# EAGLE design transmissor_v2 (EAGLE 9.6.2)
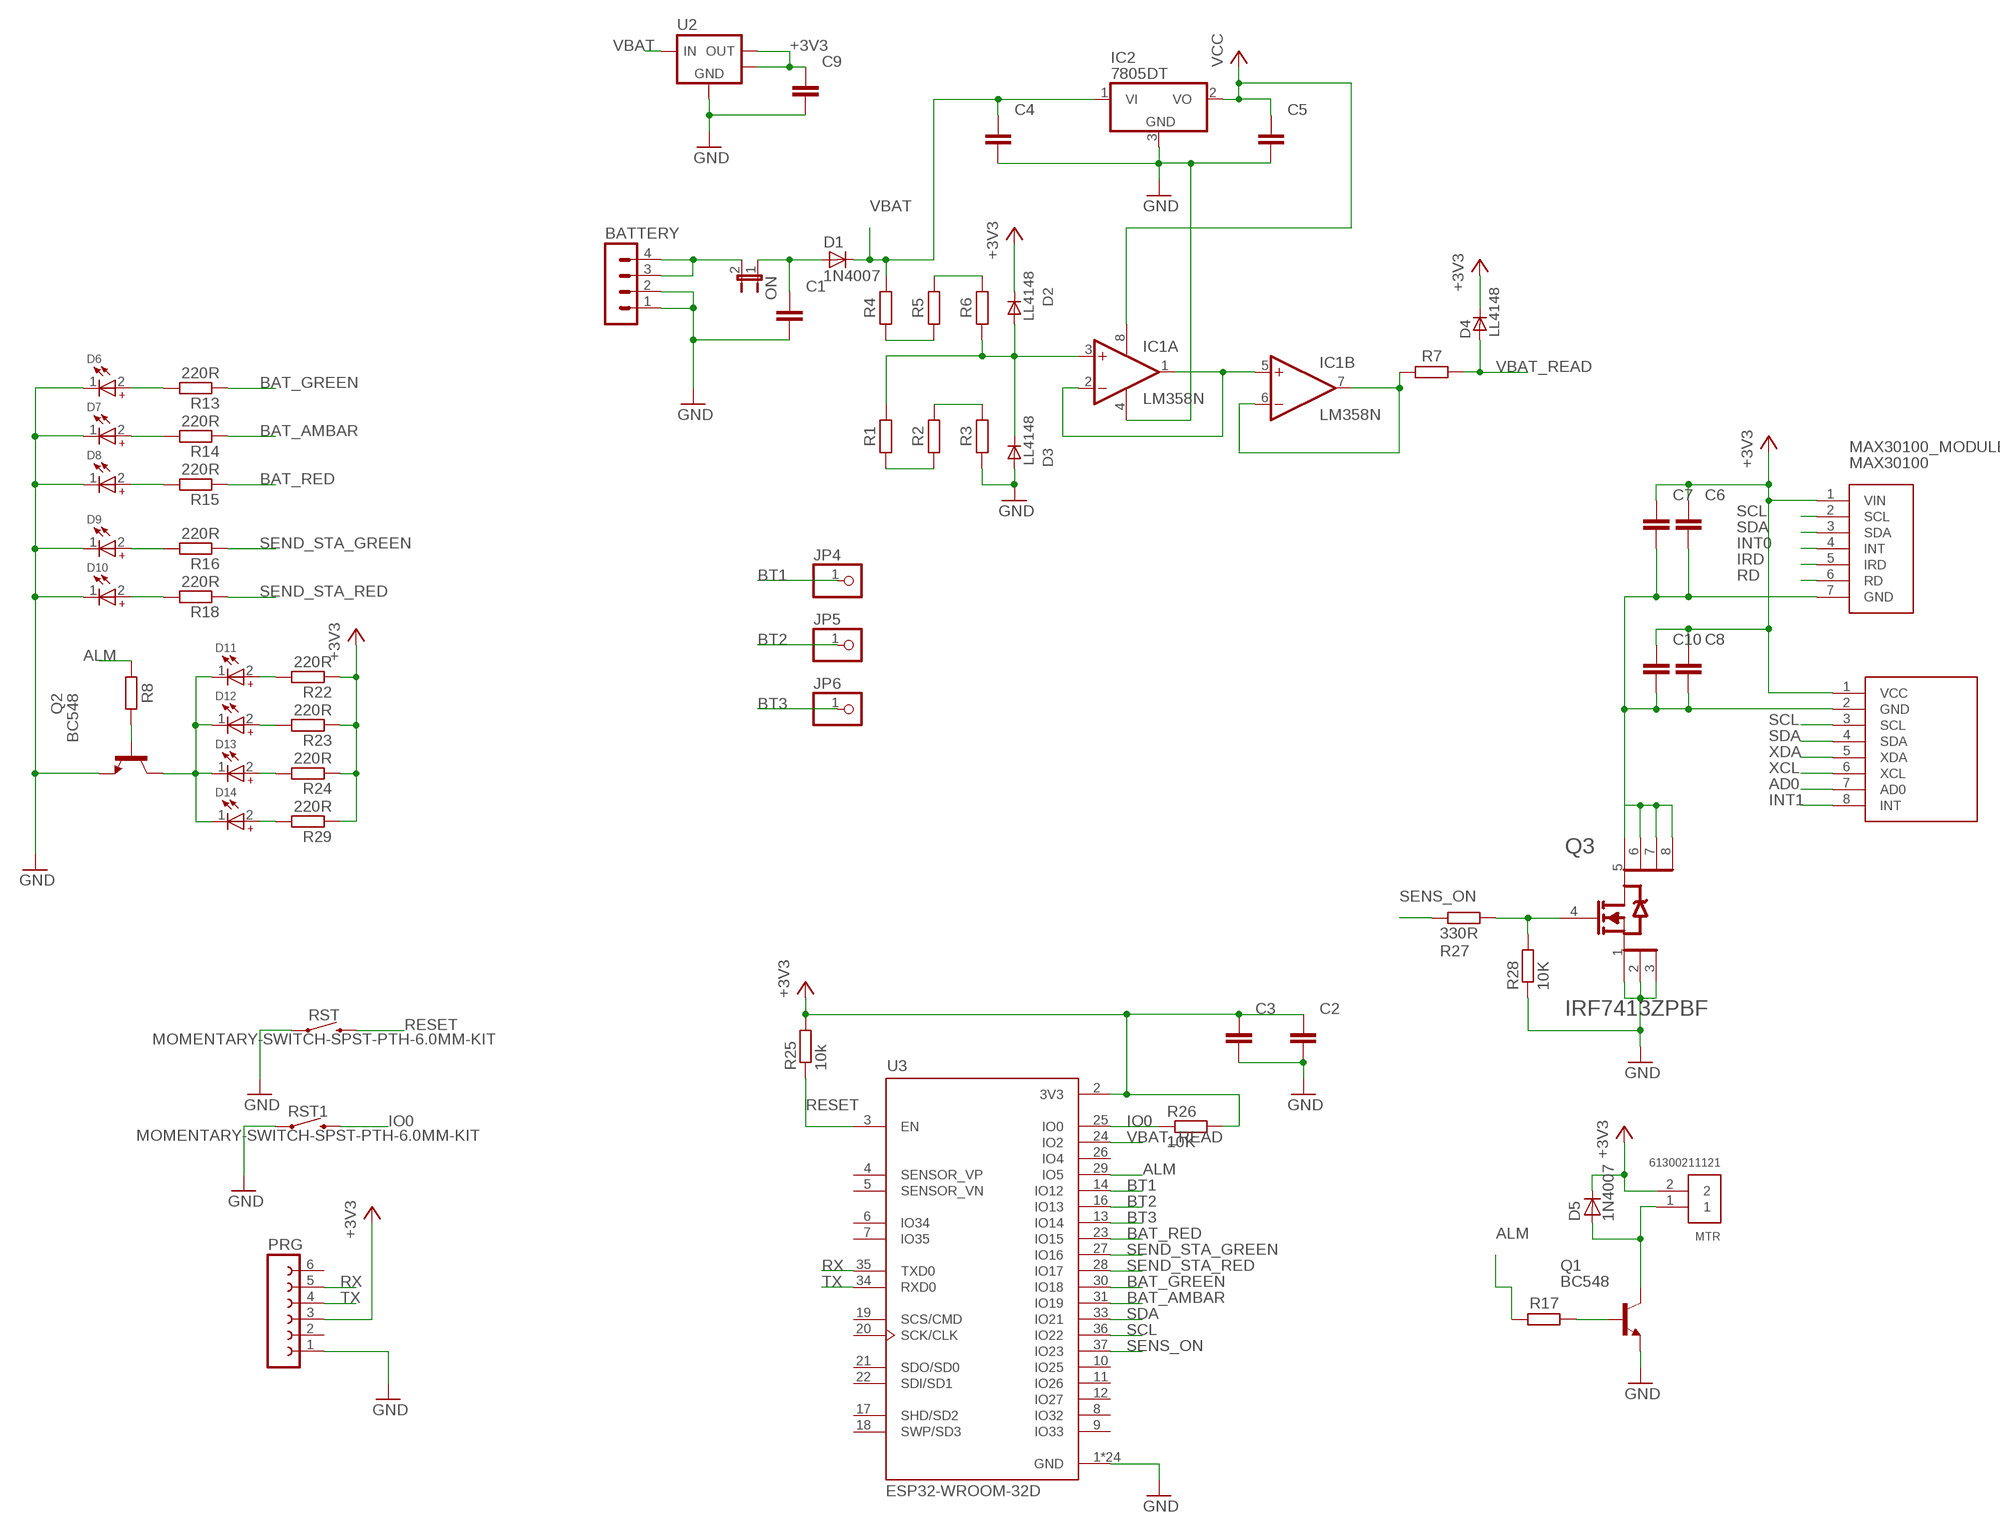
[diagram p0: schematic, sheet 1]

## Parts
BATTERY  MA04-1  [MA04-1]
C1  100nF  C_CHIP-0805(2012-METRIC)  [CAPC2012X110]
C2  100nF  C_CHIP-0805(2012-METRIC)  [CAPC2012X110]
C3  100nF  C_CHIP-0805(2012-METRIC)  [CAPC2012X110]
C4  100nF  C_CHIP-0805(2012-METRIC)  [CAPC2012X110]
C5  100nF  C_CHIP-0805(2012-METRIC)  [CAPC2012X110]
C6  100nF  C_CHIP-0805(2012-METRIC)  [CAPC2012X110]
C7  100nF  C_CHIP-0805(2012-METRIC)  [CAPC2012X110]
C8  100nF  C_CHIP-0805(2012-METRIC)  [CAPC2012X110]
C9  100nF  C_CHIP-0805(2012-METRIC)  [CAPC2012X110]
C10  100nF  C_CHIP-0805(2012-METRIC)  [CAPC2012X110]
D1  1N4007  [SMA]
D2  LL4148  [SOD80_DO213AA_MINIMELF]
D3  LL4148  [SOD80_DO213AA_MINIMELF]
D4  LL4148  [SOD80_DO213AA_MINIMELF]
D5  1N4007  [SMA]
D6  WL-SMCW_0805_150080GS75000  [WL-SMCW_0805]
D7  WL-SMCW_0805_150080AS75000  [WL-SMCW_0805]
D8  WL-SMCW_0805_150080RS75000  [WL-SMCW_0805]
D9  WL-SMCW_0805_150080GS75000  [WL-SMCW_0805]
D10  WL-SMCW_0805_150080RS75000  [WL-SMCW_0805]
D11  WL-SMCW_0805_150080RS75000  [WL-SMCW_0805]
D12  WL-SMCW_0805_150080RS75000  [WL-SMCW_0805]
D13  WL-SMCW_0805_150080RS75000  [WL-SMCW_0805]
D14  WL-SMCW_0805_150080RS75000  [WL-SMCW_0805]
IC1  LM358N  [DIL08]
IC2  7805DT  [TO252]
JP4  PINHD-1X1  [1X01]
JP5  PINHD-1X1  [1X01]
JP6  PINHD-1X1  [1X01]
MAX30100  MAX30100_MODULE  [MODULE1]
MPU6050  MPU6050MODULE  [MODULE2]
MTR  61300211121  [61300211121]
ON  JP1E  [JP1]
PRG  FE06-1  [FE06]
Q1  BC548  [TO92-EBC]
Q2  BC548  [TO92-EBC]
Q3  INFINEON_IRF7413ZPBFINFINEON_IRF7413ZPBF_0_0  [INFINEON_IRF7413ZPBF_0]
R1  2K  R_CHIP-0805(2012-METRIC)  [RESC2012X65]
R2  2K  R_CHIP-0805(2012-METRIC)  [RESC2012X65]
R3  100R  R_CHIP-0805(2012-METRIC)  [RESC2012X65]
R4  3.3K  R_CHIP-0805(2012-METRIC)  [RESC2012X65]
R5  3.3K  R_CHIP-0805(2012-METRIC)  [RESC2012X65]
R6  470R  R_CHIP-0805(2012-METRIC)  [RESC2012X65]
R7  100R  R_CHIP-0805(2012-METRIC)  [RESC2012X65]
R8  330R  R_CHIP-0805(2012-METRIC)  [RESC2012X65]
R13  220R  R-EU_R0805  [R0805]
R14  220R  R-EU_R0805  [R0805]
R15  220R  R-EU_R0805  [R0805]
R16  220R  R-EU_R0805  [R0805]
R17  330R  R_CHIP-0805(2012-METRIC)  [RESC2012X65]
R18  220R  R-EU_R0805  [R0805]
R22  220R  R-EU_R0805  [R0805]
R23  220R  R-EU_R0805  [R0805]
R24  220R  R-EU_R0805  [R0805]
R25  10k  R-EU_R0805  [R0805]
R26  10K  R-EU_R0805  [R0805]
R27  330R  R-EU_R0805  [R0805]
R28  10K  R-EU_R0805  [R0805]
R29  220R  R-EU_R0805  [R0805]
RST  MOMENTARY-SWITCH-SPST-PTH-6.0MM-KIT  [TACTILE_SWITCH_PTH_6.0MM_KIT]
RST1  MOMENTARY-SWITCH-SPST-PTH-6.0MM-KIT  [TACTILE_SWITCH_PTH_6.0MM_KIT]
U2  LM1117-SOT223  [SOT-223-3]
U3  ESP32-WROOM-32D  [MODULE_ESP32-WROOM-32D]

## Nets
+3V3: C2.1 C3.1 C6.1 C7.1 C8.1 C9.1 C10.1 D2.C D4.C D5.K(C) MAX30100.1(VIN) MPU6050.1(VCC) MTR.2 PRG.3 R22.1 R23.1 R24.1 R25.2 R26.2 R29.1 U2.2(VOUT) U2.4(HEATSINK) U3.2(3V3)
AD0: MPU6050.7(AD0)
ALM: R8.1 R17.1 U3.29(IO5)
BAT_AMBAR: R14.1 U3.31(IO19)
BAT_GREEN: R13.1 U3.30(IO18)
BAT_RED: R15.1 U3.23(IO15)
BT1: JP4.1 U3.14(IO12)
BT2: JP5.1 U3.16(IO13)
BT3: JP6.1 U3.13(IO14)
GND: BATTERY.1 BATTERY.2 C1.2 C2.2 C3.2 C4.2 C5.2 C9.2 D3.A D6.1(-) D7.1(-) D8.1(-) D9.1(-) D10.1(-) IC1.4(P:V-) IC2.3(GND) PRG.1 Q1.E Q2.E Q3.1(1_S) Q3.2(2_S) Q3.3(3_S) R3.1 R28.1 RST1.1 RST.1 U2.1(GND) U3.1(GND) U3.15(GND) U3.38(GND) U3.39_1(GND) U3.39_2(GND) U3.39_3(GND) U3.39_4(GND) U3.39_5(GND) U3.39_6(GND) U3.39_7(GND) U3.39_8(GND) U3.39_9(GND) U3.39_10(GND) U3.39_11(GND) U3.39_12(GND) U3.39_13(GND) U3.39_14(GND) U3.39_15(GND) U3.39_16(GND) U3.39_17(GND) U3.39_18(GND) U3.39_19(GND) U3.39_20(GND) U3.39_21(GND)
INT0: MAX30100.4(INT)
INT1: MPU6050.8(INT)
IO0: R26.1 RST1.3 U3.25(IO0)
IRD: MAX30100.5(IRD)
N$1: BATTERY.3 BATTERY.4 ON.2
N$2: C1.1 D1.A ON.1
N$3: IC1.6(B:-IN) IC1.7(B:OUT) R7.1
N$4: R4.1 R5.1
N$5: R5.2 R6.2
N$6: D2.A D3.C IC1.3(A:+IN) R1.2 R6.1
N$7: R1.1 R2.1
N$8: R2.2 R3.2
N$9: Q3.4(G) R27.2 R28.2
N$10: C6.2 C7.2 C8.2 C10.2 MAX30100.7(GND) MPU6050.2(GND) Q3.5(1_D) Q3.6(2_D) Q3.7(3_D) Q3.8(4_D)
N$11: D6.2(+) R13.2
N$12: D7.2(+) R14.2
N$13: D8.2(+) R15.2
N$14: D5.A MTR.1 Q1.C
N$15: Q1.B R17.2
N$16: IC1.1(A:OUT) IC1.2(A:-IN) IC1.5(B:+IN)
N$17: Q2.B R8.2
N$21: D9.2(+) R16.2
N$22: D10.2(+) R18.2
N$23: D11.1(-) D12.1(-) D13.1(-) D14.1(-) Q2.C
N$24: D11.2(+) R22.2
N$25: D12.2(+) R23.2
N$26: D13.2(+) R24.2
N$27: D14.2(+) R29.2
RD: MAX30100.6(RD)
RESET: R25.1 RST.3 U3.3(EN)
RX: PRG.5 U3.35(TXD0)
SCL: MAX30100.2(SCL) MPU6050.3(SCL) U3.36(IO22)
SDA: MAX30100.3(SDA) MPU6050.4(SDA) U3.33(IO21)
SEND_STA_GREEN: R16.1 U3.27(IO16)
SEND_STA_RED: R18.1 U3.28(IO17)
SENS_ON: R27.1 U3.37(IO23)
TX: PRG.4 U3.34(RXD0)
VBAT: C4.1 D1.K(C) IC2.1(VI) R4.2 U2.3(VIN)
VBAT_READ: D4.A R7.2 U3.24(IO2)
VCC: C5.1 IC1.8(P:V+) IC2.2(VO)
XCL: MPU6050.6(XCL)
XDA: MPU6050.5(XDA)
Unconnected: PRG.2 PRG.6 U3.4(SENSOR_VP) U3.5(SENSOR_VN) U3.6(IO34) U3.7(IO35) U3.8(IO32) U3.9(IO33) U3.10(IO25) U3.11(IO26) U3.12(IO27) U3.17(SHD/SD2) U3.18(SWP/SD3) U3.19(SCS/CMD) U3.20(SCK/CLK) U3.21(SDO/SD0) U3.22(SDI/SD1) U3.26(IO4)

## Library data of the parts
BATTERY = con-lstb:MA04-1: PIN HEADER; OC_FARNELL: unknown; OC_NEWARK: unknown
C1-C10 = Capacitor:C: Capacitor - Generic; CATEGORY: Capacitor
D1 D5 = casovac:1N4007
D2-D4 = _hhn_diodes_smd:LL4148: 1N4148 General Purpose Rectifie SMD-Version of 1N4148 Case: SOD 80 = DO 213 AA = MINIMELF (Glass) Author: Dipl.-Ing. FH Rainer Bayer HHN Hochschule Heilbronn, rainer.bayer@hs-heilbronn.de Ingenieurbüro ing-rb, mail@ing-rb.de
D6 D9 = Wurth_LEDs_WL-SMCW:WL-SMCW_0805: WL-SMCW SMT Mono-color Chip LED Waterclea Characteristics Low energy consumption High reliability Low current requirement Fast switching No UV/IR radiation Smallest SMD LED package for exceptional brightness Top view LED Wide viewing angle Better solder ability Heat dissipation Applications Backlight for mobile and portable device keypads Indoor and outdoor message boards Flat backlight for LCDs, switches and symbols Display for industrial control systems and traffic Miniaturized color effects Pedestrian mark Optical indicators Tabular backlight: LCD, telephone key-press, power-switch, display board Indoor displays Signals Identifiers Backlight for automobile DVD LED General lighting Toys <https://www.we-online.com/catalog/media/o14904v209%20Family_WL-SMCW.jpg> Details see: https://www.we-online.com/catalog/en/WL-SMCW/ Updated BY Yingchun,Shan 2020-03-18 2020(C) Wurth Elektronik; ABSTRAHLWINKEL: 140°; CHIP-TECHNOLOGY: InGaN; DATASHEET-URL: https://www.we-online.com/catalog/datasheet/150080GS75000.pdf; EMITTING-COLOR: Green; I-V-TYP: 450mcd; LAMDA-DOM-TYP: 525nm; LAMDA-PEAK-TYP: 515nm; PART-NUMBER: 150080GS75000; V-F-TYP: 3.2V
D7 = Wurth_LEDs_WL-SMCW:WL-SMCW_0805: WL-SMCW SMT Mono-color Chip LED Waterclea Characteristics Low energy consumption High reliability Low current requirement Fast switching No UV/IR radiation Smallest SMD LED package for exceptional brightness Top view LED Wide viewing angle Better solder ability Heat dissipation Applications Backlight for mobile and portable device keypads Indoor and outdoor message boards Flat backlight for LCDs, switches and symbols Display for industrial control systems and traffic Miniaturized color effects Pedestrian mark Optical indicators Tabular backlight: LCD, telephone key-press, power-switch, display board Indoor displays Signals Identifiers Backlight for automobile DVD LED General lighting Toys <https://www.we-online.com/catalog/media/o14904v209%20Family_WL-SMCW.jpg> Details see: https://www.we-online.com/catalog/en/WL-SMCW/ Updated BY Yingchun,Shan 2020-03-18 2020(C) Wurth Elektronik; ABSTRAHLWINKEL: 140°; CHIP-TECHNOLOGY: AlInGaP; DATASHEET-URL: https://www.we-online.com/catalog/datasheet/150080AS75000.pdf; EMITTING-COLOR: Amber; I-V-TYP: 130mcd; LAMDA-DOM-TYP: 605nm; LAMDA-PEAK-TYP: 610nm; PART-NUMBER: 150080AS75000; V-F-TYP: 2V
D8 D10-D14 = Wurth_LEDs_WL-SMCW:WL-SMCW_0805: WL-SMCW SMT Mono-color Chip LED Waterclea Characteristics Low energy consumption High reliability Low current requirement Fast switching No UV/IR radiation Smallest SMD LED package for exceptional brightness Top view LED Wide viewing angle Better solder ability Heat dissipation Applications Backlight for mobile and portable device keypads Indoor and outdoor message boards Flat backlight for LCDs, switches and symbols Display for industrial control systems and traffic Miniaturized color effects Pedestrian mark Optical indicators Tabular backlight: LCD, telephone key-press, power-switch, display board Indoor displays Signals Identifiers Backlight for automobile DVD LED General lighting Toys <https://www.we-online.com/catalog/media/o14904v209%20Family_WL-SMCW.jpg> Details see: https://www.we-online.com/catalog/en/WL-SMCW/ Updated BY Yingchun,Shan 2020-03-18 2020(C) Wurth Elektronik; ABSTRAHLWINKEL: 140°; CHIP-TECHNOLOGY: AlInGaP; DATASHEET-URL: https://www.we-online.com/catalog/datasheet/150080RS75000.pdf; EMITTING-COLOR: Red; I-V-TYP: 150mcd; LAMDA-DOM-TYP: 625nm; LAMDA-PEAK-TYP: 630nm; PART-NUMBER: 150080RS75000; V-F-TYP: 2V
IC1 = linear:LM358: OP AMP also LM158; LM258; LM2904 Source: http://cache.national.com/ds/LM/LM158.pdf
IC2 = linear:78*: Positive VOLTAGE REGULATOR Source: http://cache.national.com/ds/LM/LM78L05.pdf http://www.fairchildsemi.com/ds/LM/LM7805.pdf
JP4-JP6 = adafruit:PINHD-1X1: Pin header 1x1 for 0.1" spacing With round pins
MAX30100 = my_lib:MAX30100_MODULE
MPU6050 = my_lib:MPU6050
MTR = Headers:61300211121: CONN HEADER VERT 2POS 2.54MM Manufacturer's datasheet <https://katalog.we-online.de/em/datasheet/6130xx11121.pdf>; CREATED_BY: PCBLayout.com; DIGI_KEY_PART_NUMBER: 732-5315-ND; MANUFACTURER: Wurth Electronics Inc.; MPN: 61300211121
ON = jumper:JP1E: JUMPER
PRG = con-lsta:FE06-1: FEMALE HEADER; OC_FARNELL: unknown; OC_NEWARK: unknown
Q1 Q2 = transistor-npn:BC548*: NPN Transistor
Q3 = Infineon - IRF7413ZPBF:INFINEON_IRF7413ZPBF: HEXFET Power MOSFET; CENTROID_NOT_SPECIFIED: No; DATASHEET: http://www.infineon.com/dgdl/irf7413zpbf.pdf?fileId=5546d462533600a4015355fab6901bc2; DIGIKEY_DESCRIPTION: TRANS MOSFET N-CH 30V 13A 8-SOIC; DIGIKEY_PART_NUMBER: IRF7413ZPBF-ND; LEAD_FREE: yes; MF: Infineon; MOUSER_PART_NUMBER: 942-IRF7413ZPBF; MPN: IRF7413ZPBF; PACKAGE: SO8; PREFIX: Q; ROHS: yes; TEMPERATURE_RANGE_HIGH: +150°C; TEMPERATURE_RANGE_LOW: -55°C
R1-R8 R17 = Resistor:R: Resistor Fixed - Generic; CATEGORY: Resistor; SUB-CATEGORY: Fixed
R13-R16 R18 R22-R29 = rcl:R-EU_: RESISTOR, European symbol; SPICEPREFIX: R
RST RST1 = SparkFun-Switches:MOMENTARY-SWITCH-SPST: Momentary Switch (Pushbutton) - SPST Normally-open (NO) SPST momentary switches (buttons, pushbuttons). Variants PTH-12MM - 12mm square, through-hole Momentary Pushbutton Switch - 12mm Square <https://www.sparkfun.com/products/9190> (COM-09190) PTH-6.0MM, PTH-6.0MM-KIT - 6.0mm square, through-hole Mini Pushbutton Switch <https://www.sparkfun.com/products/97> (COM-00097) KIT package intended for soldering kit's - only one side of pads' copper is exposed. PTH-RIGHT-ANGLE-KIT - Right-angle, through-hole Right Angle Tactile Button <https://www.sparkfun.com/products/10791> - Used on SparkFun BigTime Watch Kit <https://www.sparkfun.com/products/11734> SMD-12MM - 12mm square, surface-mount Tactile Button - SMD (12mm) <https://www.sparkfun.com/products/12993> (COM-12993) Used on SparkFun PicoBoard <https://www.sparkfun.com/products/11888> SMD-4.5MM - 4.5mm Square Trackball Switch Used on SparkFun Blackberry Trackballer Breakout <https://www.sparkfun.com/products/13169> SMD-4.6MMX2.8MM - 4.60mm x 2.80mm, surface mount Used on SparkFun SAMD21 Mini Breakout <https://www.sparkfun.com/products/13664> SMD-5.2MM, SMD-5.2-REDUNDANT - 5.2mm square, surface-mount Mini Pushbutton Switch - SMD <https://www.sparkfun.com/products/8720> (COM-08720) Used on Arduino Pro Mini <https://www.sparkfun.com/products/11114> REDUNDANT package connects both switch circuits together SMD-6.0X3.5MM - 6.0 x 3.5mm, surface mount Momentary Reset Switch SMD <https://www.sparkfun.com/products/8229> (COM-08229) SMD-6.2MM-TALL - 6.2mm square, surface mount Tactile Button - SMD (6mm) <https://www.sparkfun.com/products/12992> Used on SparkFun Digital Sandbox <https://www.sparkfun.com/products/12651> SMD-RIGHT-ANGLE - Right-angle, surface mount Used on SparkFun Block for Intel® Edison - Arduino <https://www.sparkfun.com/products/13036>; PROD_ID: SWCH-08441; SF_SKU: COM-00097
U2 = bt_regulator:LM1117: LDO Voltage Regulator NCP1117 Output Current in Excess of 1.0 A 1.2 V Maximum Dropout Voltage at 800 mA Over Temperature Fixed Output Voltages of 1.5, 1.8, 1.9, 2.0, 2.5, 2.85, 3.3, 5.0, and 12 V Adjustable Output Voltage Option No Minimum Load Requirement for Fixed Voltage Output Devices Reference/Output Voltage Trimmed to ±1.0% Current Limit, Safe Operating and Thermal Shutdown Protection Operation to 20 V Input NCV Prefix for Automotive and Other Applications Requiring Unique Site and Control Change Requirements; AEC−Q100 Qualified and PPAP Capable datasheet.pdf <http://www.onsemi.com/pub/Collateral/NCP1117-D.PDF> LM1117 Available in 1.8 V, 2.5 V, 3.3 V, 5 V, and adjustable versions Output Current 800 mA Current Limiting and Thermal Protection Space-Saving SOT-223 and WSON Packages Line Regulation 0.2% (Maximum) Load Regulation 0.4% (Maximum) Temperature: LM1117: 0°C to 125°C; LM1117I: −40°C to 125°C LM1117 (Rev. N) is a series of low dropout voltage regulators of 1.2V at 800mA of load current. It has the same pin-out as Texas Instruments' industry standard LM317. The LM1117-N is available in an adjustable version, available in five fixed voltages, 1.8V, 2.5V, 2.85V, 3.3V, and 5V. The LM1117-N offers current limiting and thermal shutdown. Its circuit includes a zener trimmed to within ±1%. datasheet.pdf <http://www.ti.com/lit/ds/symlink/lm1117.pdf>
U3 = ESP32-WROOM-32D:ESP32-WROOM-32D: Bluetooth, WiFi 802.11b/g/n, Bluetooth v4.2 + EDR, Class 1, 2 and 3 Transceiver Module 2.4GHz ~ 2.5GHz Integrated, Trace Surface Mount Check prices <https://pricing.snapeda.com/parts/ESP32-WROOM-32D/Espressif%20Systems/view-part?ref=eda>; AVAILABILITY: Bad; DESCRIPTION: Bluetooth, WiFi 802.11b/g/n, Bluetooth v4.2 +EDR, Class 1, 2 and 3 Transceiver Module 2.4GHz ~ 2.5GHz Integrated; MF: Espressif Systems; MP: ESP32-WROOM-32D; PACKAGE: Module Espressif Systems; PRICE: None

## Board
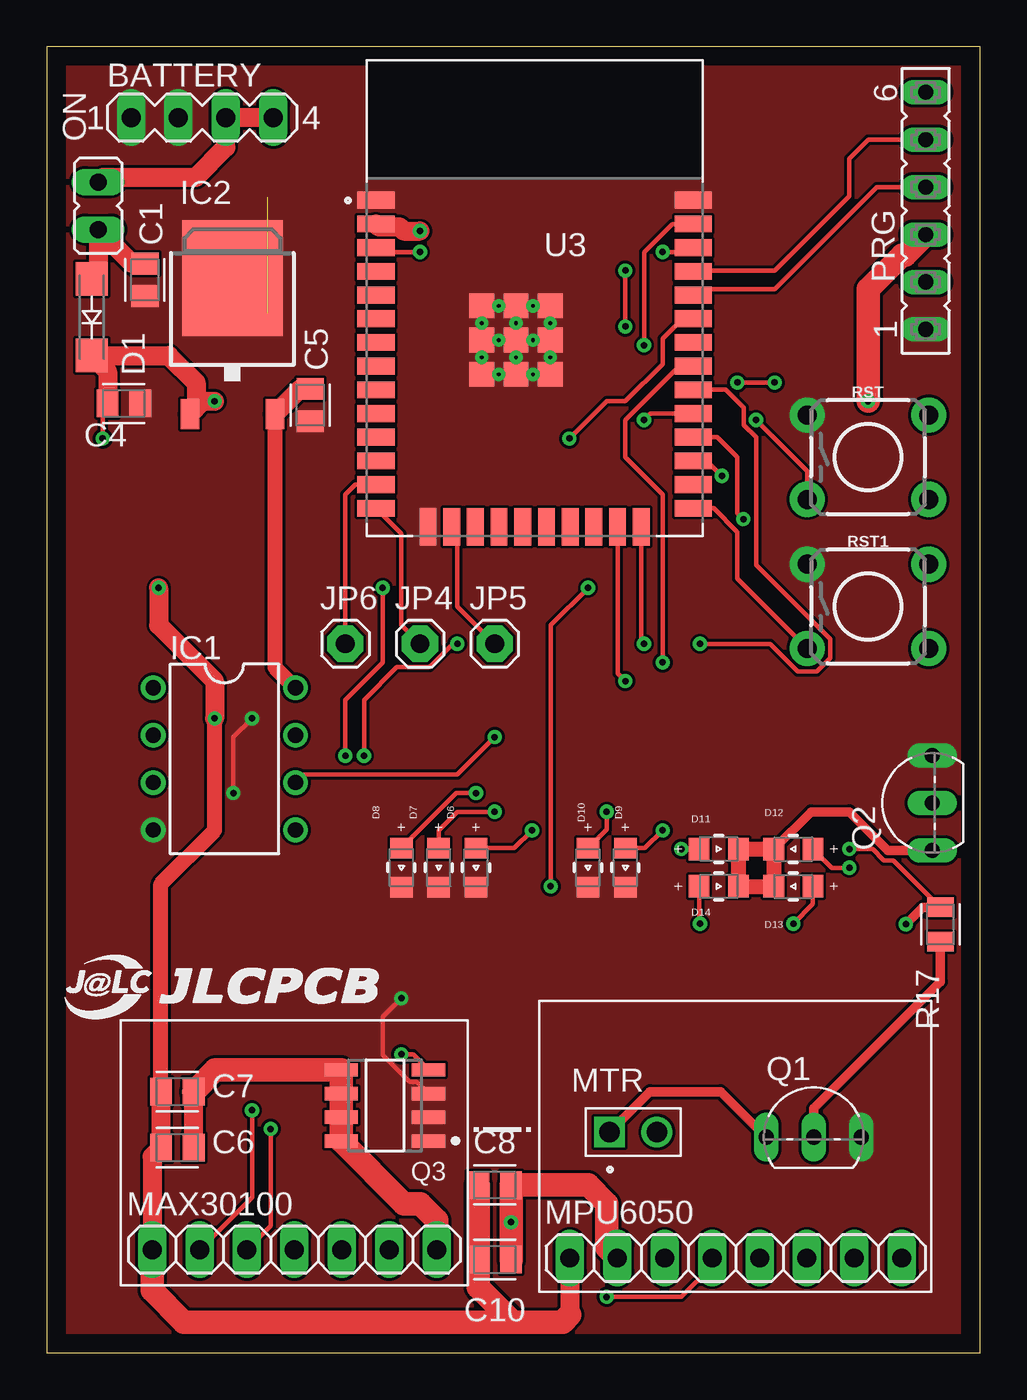
[diagram p1: board, top side]
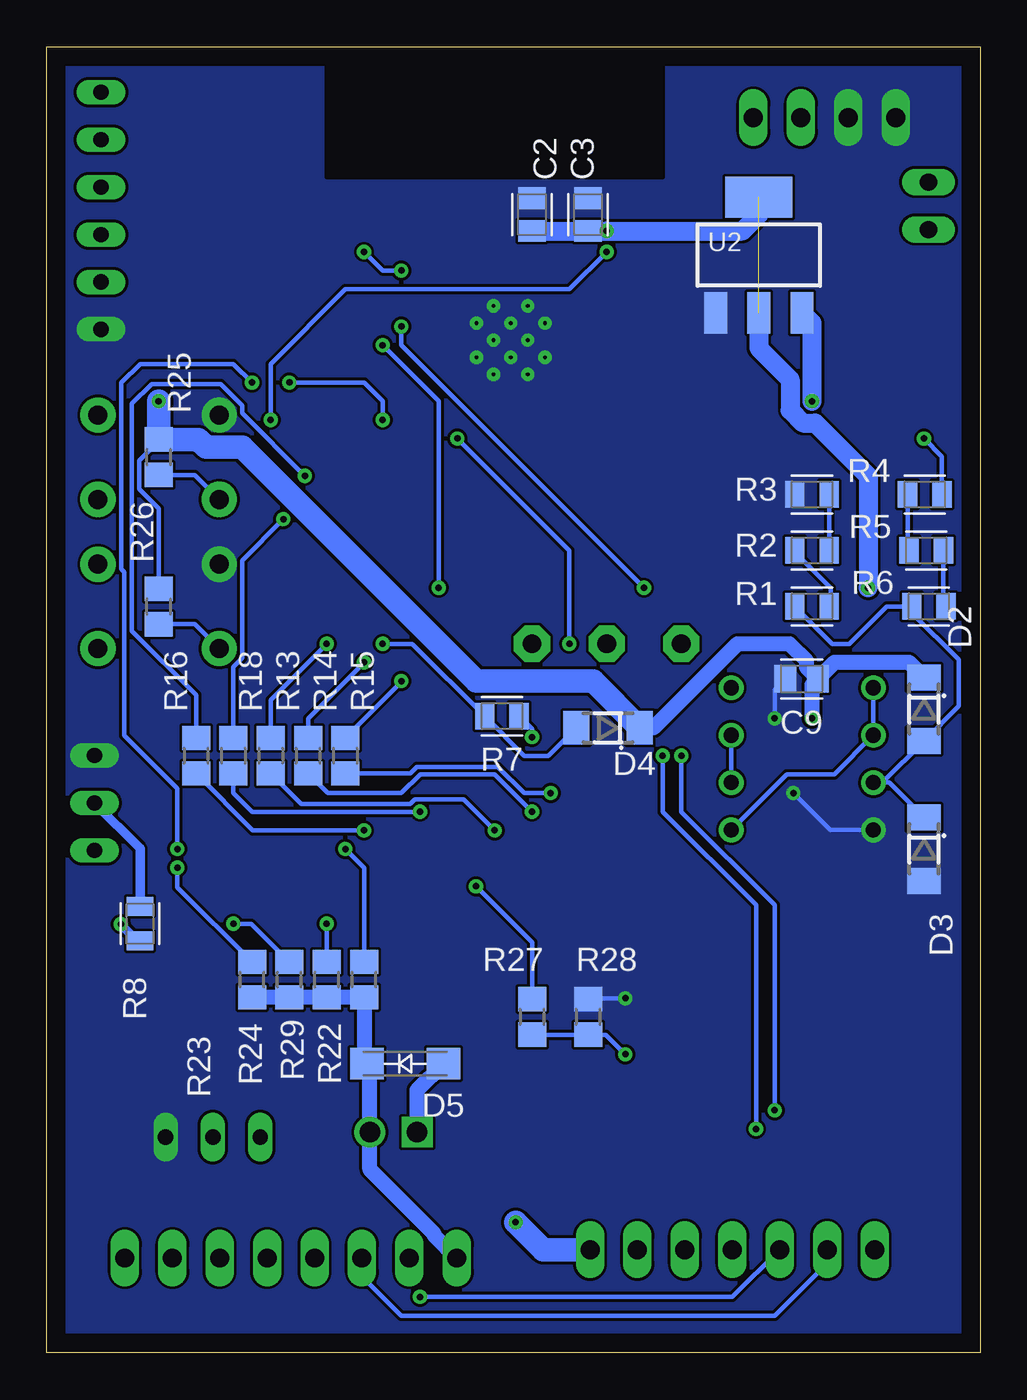
[diagram p2: board, bottom side, seen from below]

Size 50 x 70 mm. Coordinates in mm from the lower left corner, seen from the top.
Outline: 0,0 50,0 50,70 0,70 0,0
Copper layers (1*16): Top 0.035mm / dielectric 1.5mm / Bottom 0.035mm
Design rules "default": minimum track width 6mil, minimum drill 0.35mm, track to track 6mil, track to pad 6mil, pad to pad 6mil, via to via 6mil, smd to smd 6mil, copper to edge 40mil, drill to drill 6mil, minimum pad ring 10mil, minimum via ring 8mil, stop-mask expansion 4mil, vias tented up to drill 0mil, thermal gap 10mil

### Footprints (pad centres in the part's own frame; a part is rotated, then mirrored left to right if it is on the bottom)
MA04-1 = drill 1.016 long: 1 -3.81,0; 2 -1.27,0; 3 1.27,0; 4 3.81,0
CAPC2012X110 = smd 1.165 x 1.465: 1 -0.875,0; 2 0.875,0
SMA = smd 1.8 x 1.7: A -2.05,0; K 2.05,0
SOD80_DO213AA_MINIMELF = smd 1.4 x 1.8: A 1.7,0; C -1.7,0
WL-SMCW_0805 = smd 1.1 x 1.2: 1 -1.05,0; 2 1.05,0
DIL08 = drill 0.813 pad 1.27: 1 -3.81,-3.81; 2 -1.27,-3.81; 3 1.27,-3.81; 4 3.81,-3.81; 5 3.81,3.81; 6 1.27,3.81; 7 -1.27,3.81; 8 -3.81,3.81
TO252 = smd 1 x 1.6: 1 -2.28,-4.8; 2 2.28,-4.8 | smd 5.4 x 6.2: 3 0,2.5
1X01 = drill 1.016 pad 1.93 octagon: 1 0,0
MODULE1 = drill 1.016 long: 1 -7.31,-5.09; 2 -4.77,-5.09; 3 -2.23,-5.09; 4 0.31,-5.09; 5 2.85,-5.09; 6 5.39,-5.09; 7 7.93,-5.09
MODULE2 = drill 1.016 long: 1 1.64,1.81; 2 4.18,1.81; 3 6.72,1.81; 4 9.26,1.81; 5 11.8,1.81; 6 14.34,1.81; 7 16.88,1.81; 8 19.42,1.81
61300211121 = drill 1.1 square: 1 -1.27,0 | drill 1.1: 2 1.27,0
JP1 = drill 0.914 long: 1 0,-1.27; 2 0,1.27
FE06 = drill 0.813 long: 1 -6.35,0; 2 -3.81,0; 3 -1.27,0; 4 1.27,0; 5 3.81,0; 6 6.35,0
TO92-EBC = drill 0.813 long: B 0,-1.27; C -2.54,-1.27; E 2.54,-1.27
INFINEON_IRF7413ZPBF_0 = smd 0.72 x 1.78: 1 -1.905,-2.34; 2 -0.635,-2.34; 3 0.635,-2.34; 4 1.905,-2.34; 5 1.905,2.34; 6 0.635,2.34; 7 -0.635,2.34; 8 -1.905,2.34
RESC2012X65 = smd 1.031 x 1.42: 1 -0.919,0; 2 0.919,0
R0805 = smd 1.3 x 1.5: 1 -0.95,0; 2 0.95,0
TACTILE_SWITCH_PTH_6.0MM_KIT = drill 1.016 pad 1.88: 1 -3.251,2.261; 2 3.251,2.261; 3 -3.251,-2.261; 4 3.251,-2.261
SOT-223-3 = smd 1.219 x 2.235: 1 -2.311,-3.099; 2 0,-3.099; 3 2.311,-3.099 | smd 3.6 x 2.2: 4 0,3.099
MODULE_ESP32-WROOM-32D = smd 2 x 0.9: 1 -8.5,5.26; 2 -8.5,3.99; 3 -8.5,2.72; 4 -8.5,1.45; 5 -8.5,0.18; 6 -8.5,-1.09; 7 -8.5,-2.36; 8 -8.5,-3.63; 9 -8.5,-4.9; 10 -8.5,-6.17; 11 -8.5,-7.44; 12 -8.5,-8.71; 13 -8.5,-9.98; 14 -8.5,-11.25; 25 8.5,-11.25; 26 8.5,-9.98; 27 8.5,-8.71; 28 8.5,-7.44; 29 8.5,-6.17; 30 8.5,-4.9; 31 8.5,-3.63; 32 8.5,-2.36; 33 8.5,-1.09; 34 8.5,0.18; 35 8.5,1.45; 36 8.5,2.72; 37 8.5,3.99; 38 8.5,5.26 | smd 0.9 x 2: 15 -5.715,-12.25; 16 -4.445,-12.25; 17 -3.175,-12.25; 18 -1.905,-12.25; 19 -0.635,-12.25; 20 0.635,-12.25; 21 1.905,-12.25; 22 3.175,-12.25; 23 4.445,-12.25; 24 5.715,-12.25 | smd 1.33 x 1.33: 39_1 -2.835,-0.405; 39_2 -1,-0.405; 39_3 0.835,-0.405; 39_4 -2.835,-2.24; 39_5 -1,-2.24; 39_6 0.835,-2.24; 39_7 -2.835,-4.075; 39_8 -1,-4.075; 39_9 0.835,-4.075 | drill 0.2 pad 0.3: 39_10 -1.917,-0.405; 39_11 -0.083,-0.405; 39_12 -2.835,-1.323; 39_13 -1,-1.323; 39_14 0.835,-1.323; 39_15 -1.917,-2.24; 39_16 -0.083,-2.24; 39_17 -2.835,-3.158; 39_18 -1,-3.158; 39_19 0.835,-3.158; 39_20 -1.917,-4.075; 39_21 -0.083,-4.075

### Placement (x,y rotation side)
BATTERY  8.33,66.2 0 top
C1  5.26,57.5 270 top
C2  24,61 90 bottom
C3  21,61 90 bottom
C4  4.14,50.88 0 top
C5  14.12,50.79 270 top
C6  7,11 0 top
C7  7,14 0 top
C8  24,9 0 top
C9  9.56,36.12 180 bottom
C10  24,5 0 top
D1  2.41,55.5 270 top
D2  3,34.5 270 bottom
D3  3,27 270 bottom
D4  19.93,33.5 180 bottom
D5  30.79,15.5 180 bottom
D6  23,26 90 top
D7  21,26 90 top
D8  19,26 90 top
D9  31,26 90 top
D10  29,26 90 top
D11  36,27 180 top
D12  40,27 0 top
D13  40,25 0 top
D14  36,25 180 top
IC1  9.52,31.83 270 top
IC2  9.95,55.1 0 top
JP4  20,38 0 top
JP5  24,38 0 top
JP6  16,38 0 top
MAX30100  12.96,10.62 0 top
MPU6050  26.39,3.27 0 top
MTR  31.42,11.83 0 top
ON  2.76,61.47 0 top
PRG  47.09,61.2 90 top
Q1  41.09,12.83 0 top
Q2  46.17,29.47 90 top
Q3  18.12,13.26 90 top
R1  9,40 180 bottom
R2  9,43 0 bottom
R3  9,46 0 bottom
R4  2.96,46 0 bottom
R5  2.88,43 0 bottom
R6  2.74,40 0 bottom
R7  25.61,34.12 180 bottom
R8  45,23 90 bottom
R13  38,32 270 bottom
R14  36,32 270 bottom
R15  34,32 270 bottom
R16  42,32 270 bottom
R17  47.88,22.96 270 top
R18  40,32 270 bottom
R22  33,20 90 bottom
R23  39,20 90 bottom
R24  37,20 90 bottom
R25  44,48 90 bottom
R26  44,40 90 bottom
R27  24,18 270 bottom
R28  21,18 270 bottom
R29  35,20 90 bottom
RST  44,48 0 top
RST1  44,40 0 top
U2  11.85,58.83 0 bottom
U3  26.14,56.51 0 top

### Tracks (layer width: path | path; a pad name or v marks a point on that pad's centre or on a via)
+3V3  (via drill 0.35)  (1 unrouted)
  Top 0.813: C7.1 6.12,25.12 9,28 v9,34
  Top 1.016: U3.2 17.8,60.34 18.91,60.34 19.13,60.12 v20,60.12 | C7.1 C6.1 5.65,10.53 MAX30100.1 | v6,41 6,39 9,36 v9,34 | MPU6050.1 28.03,2.03
  Top 1.27: C8.1 C10.1 23.12,3.53 25,1.65 | 25,1.65 27.65,1.65 28.03,2.03 | MAX30100.1 5.65,3.35 7.35,1.65 25,1.65 | PRG.3 46,58.84 45.83,58.84 44,57.01 v44,51
  Bottom 0.254: 44.05,48.95 R25.2 | R26.2 44,45.25 45.03,46.28 45.03,47.82 44,48.85 44,49
  Bottom 0.813: MPU6050.1 29.25,6.3 29.25,6.39 32.69,9.83 MTR.2 32.69,15.35 D5.K 33,15.66 R22.1 R29.1 R24.1 R23.1 | D2.C 3.8,37 7.8,37 C9.1 | C9.1 9.29,36.73 9.29,37.08 10.21,38 13,38 17.5,33.5 D4.C | v9,34 9,35.8 C9.1
  Bottom 1.016: U2.4 11.85,61 12.73,60.12 v20,60.12 C3.1 C2.1 | U2.2 11.85,53.85 10.17,52.17 10.17,50.52 9.48,49.83 8.83,49.83 6,47 v6,41
  Bottom 1.27: v44,51 44,49 44.05,48.95 | R25.2 41.88,48.95 41.46,48.53 39.53,48.53 27,36 20.73,36 D4.C
ALM  (via drill 0.35)
  Top 0.254: R17.1 45.36,26.4 44.85,26.4 44.25,27 v43,27 | v39,52 v37,52 | v32,50 32.34,50.34 U3.29
  Top 0.508: v46.03,22.97 46.94,23.88 R17.1
  Bottom 0.254: v43,27 43,30.25 45.84,33.1 45.84,41.84 46,42 46,52 45,53 40,53 v39,52 | v37,52 33,52 32,51 v32,50
  Bottom 0.508: R8.1 45.14,22.08 v46.03,22.97
BAT_AMBAR  (via drill 0.35)
  Top 0.254: U3.31 33.88,52.88 31,50 31,48 33,46 v33,37
  Bottom 0.254: R14.1 36,34 v33,37
BAT_GREEN  (via drill 0.35)
  Top 0.254: v35,38 38.76,38 40.24,36.52 41.25,36.52 41.97,37.23 41.97,38.24 38,42.21 38,49.07 37.34,49.73 37.34,50.66 36.39,51.61 U3.30
  Bottom 0.254: R13.1 38,35 v35,38
BAT_RED  (via drill 0.35)
  Top 0.254: v31,36 30.58,36.41 U3.23
  Bottom 0.254: R15.1 31,35.95 v31,36
BT1
  Top 0.254: U3.14 19,43.9 19,39 JP4.1
BT2
  Top 0.254: U3.16 22,43.95 22,40 JP5.1
BT3
  Top 0.254: U3.13 16.53,46.53 16,46 JP6.1
GND  (via drill 0.35)
  Top 0.254: v10,30 10,33 v11,34 | Q3.3 19.83,14.53 19.45,14.53 18,15.98 18,18 v19,19
  Bottom 0.254: IC1.4 8.02,28.02 v10,30 | v11,34 11,35.56 C9.2 | v19,19 20.95,19 R28.1
  cutout Bottom (no thermals): 17,69 17,63 35,63 35,69
  pour Bottom (no thermals): 0,70 0,0 50,0 50,70
  pour Top (no thermals): 0,70 50,70 50,0 0,0
IO0
  Top 0.254: RST1.3 37,41.49 37,44 35.74,45.26 U3.25
  Bottom 0.254: RST1.3 42.06,39.05 R26.1
N$1
  Top 1.016: BATTERY.4 BATTERY.3 9.6,64.6 8,63 3.02,63 ON.2
N$2
  Top 1.016: D1.A 2.76,57.9 ON.1 4.58,58.38 C1.1
N$3  (via drill 0.35)
  Top 0.254: v24,33 22,31 13.77,31 IC1.6
  Bottom 0.254: IC1.6 IC1.7 | R7.1 24,33.43 v24,33
N$4
  Bottom 0.254: R4.1 3.88,43.08 R5.1
N$5
  Bottom 0.254: R5.2 1.96,40.14 R6.2
N$6
  Bottom 0.254: R1.2 7.92,38 7,38 5,40 R6.1 3.66,39.66 1.14,37.14 1.14,34.66 D2.A 5.24,30.56 IC1.3 4.86,30.56 D3.C
N$7
  Bottom 0.254: R2.1 9.92,42.92 8,41 8,40.08 R1.1
N$8
  Bottom 0.254: R3.2 R2.2
N$9  (via drill 0.35)
  Top 0.254: Q3.4 19.62,16 v19,16
  Bottom 0.254: R27.2 R28.2 20.05,17.05 v19,16
N$10  (via drill 0.35)
  Top 1.016: C6.2 C7.2
  Top 1.27: C7.2 9.04,15.16 Q3.5 Q3.6 Q3.7 Q3.8 19.13,8 20,8 20.89,7.11 MAX30100.7 | C10.2 v24.88,7 C8.2 29,9 30,8 30,5.65 MPU6050.2
  Bottom 1.27: MAX30100.7 23.41,5.53 v24.88,7
N$11  (via drill 0.35)
  Top 0.254: v26,28 25.05,27.05 D6.2
  Bottom 0.254: R13.2 36.36,29.41 30.52,29.41 30.27,29.66 27.66,29.66 v26,28
N$12  (via drill 0.35)
  Top 0.254: v24,29 22,29 21,28 D7.2
  Bottom 0.254: R14.2 34.95,30 31,30 30,31 26,31 v24,29
N$13  (via drill 0.35)
  Top 0.254: v23,30 21.95,30 D8.2
  Bottom 0.254: R15.2 30.52,31.05 30.17,31.41 25.83,31.41 24.43,30 v23,30
N$14
  Top 0.508: MTR.1 32.32,14 36.11,14 Q1.C
  Bottom 0.813: MTR.1 30.15,14.09 D5.A
N$15
  Top 0.508: Q1.B 41.09,13.09 47.88,19.88 R17.2
N$16
  Bottom 0.254: IC1.1 IC1.2 7.81,31 10.35,31 IC1.5
N$17
  Bottom 0.508: R8.2 45,27.03 Q2.B
N$21  (via drill 0.35)
  Top 0.254: v33,28 32.05,27.05 D9.2
  Bottom 0.254: R16.2 38.95,28 v33,28
N$22  (via drill 0.35)
  Top 0.254: v30,29 30,28.05 D10.2
  Bottom 0.254: R18.2 40,30 39,29 v30,29
N$23
  Top 0.508: D12.1 40.95,29 43,29 45.07,26.93 Q2.C
  Top 0.813: D11.1 D12.1 D13.1 D14.1 D11.1
N$24  (via drill 0.35)
  Top 0.254: v34,27 D11.2
  Bottom 0.254: R22.2 33,26 v34,27
N$25  (via drill 0.35)
  Top 0.254: v43,26 42.05,26 D12.2
  Bottom 0.254: R23.2 43,24.95 v43,26
N$26  (via drill 0.35)
  Top 0.254: v40,23 41.05,24.05 D13.2
  Bottom 0.254: R24.2 39.05,23 v40,23
N$27  (via drill 0.35)
  Top 0.254: v35,23 34.95,23.05 D14.2
  Bottom 0.254: R29.2 v35,23
RESET  (via drill 0.35)
  Top 0.254: RST.3 40.75,47.25 v38,50 | U3.3 17.87,59 v20,59
  Bottom 0.254: RST.3 42.06,47.05 R25.1 | v20,59 22,57 34,57 38,53 v38,50
RX
  Top 0.254: U3.35 34.68,58 39,58 43,62 43,64 44.01,65.01 PRG.5
SCL  (via drill 0.35)
  Top 0.254: MAX30100.2 11,8.34 v11,13 | v16,32 16,35 18,37 v18,41 | v31,55 v31,58 | v33,59 34.41,59 U3.36
  Bottom 0.254: MAX30100.2 8.19,4.81 11,2 31,2 33.11,4.11 MPU6050.3 | v11,13 11,24 16,29 v16,32 | v18,41 31,54 v31,55 | v31,58 32,58 v33,59
SDA  (via drill 0.35)
  Top 0.254: v30,3 34,3 35.65,4.65 MPU6050.4 | MAX30100.3 12,6.8 v12,12 | v17,32 17,35 18.76,36.76 20.52,36.76 21.76,38 v22,38 | v28,49 30,51 31,51 33,53 33,54.36 34.06,55.42 U3.33
  Bottom 0.254: MAX30100.3 13.26,3 v30,3 | v17,32 17,29 12,24 v12,12 | v22,38 22,43 v28,49
SEND_STA_GREEN  (via drill 0.35)
  Top 0.254: v36.17,47 35.37,47.8 U3.27
  Bottom 0.254: v36.17,47 39.53,50.36 39.53,50.77 40.68,51.91 44.38,51.91 45.44,50.86 45.44,38.69 42,35.25 R16.1
SEND_STA_RED  (via drill 0.35)
  Top 0.254: v37.32,44.68 37,45 37,48 35.93,49.07 U3.28
  Bottom 0.254: R18.1 40,36.76 39.53,37.23 39.53,42.47 v37.32,44.68
SENS_ON  (via drill 0.35)
  Top 0.254: v27,25 27,39 v29,41 | v32,54 32,59 33.5,60.5 U3.37
  Bottom 0.254: R27.1 24,22 v27,25 | v29,41 29,51 v32,54
TX
  Top 0.254: U3.34 34.95,57 39,57 44.47,62.47 PRG.4
VBAT  (via drill 0.35)
  Top 0.254: v3,49 3,50.62 C4.1
  Top 1.016: C4.1 3.26,52.6 D1.K 6.55,53.45 8,52 8,50.63 IC2.1 8.37,51 v9,51
  Bottom 0.254: R4.2 2.04,48.04 v3,49
  Bottom 1.016: v9,51 9,55.19 U2.3
VBAT_READ  (via drill 0.35)
  Top 0.254: v32,38 31.85,38.14 U3.24
  Bottom 0.254: D4.A 23.13,32 24.41,32 R7.2 30.41,38 v32,38
VCC
  Top 0.813: IC2.2 12.23,36.74 IC1.8
  Top 1.016: IC2.2 13.6,51.67 C5.1